# EAGLE schematic Servo_Control (EAGLE 9.1.3)
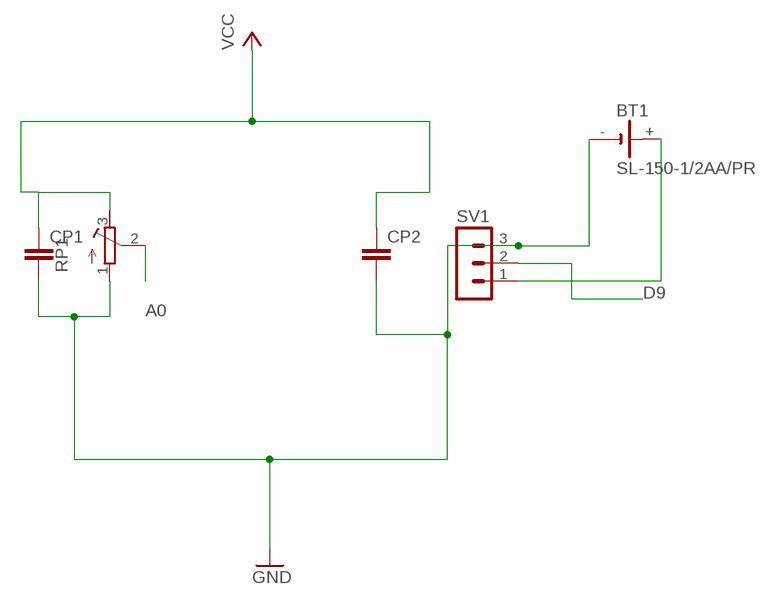
[diagram p0: schematic, sheet 1]

## Parts
BT1  SL-150-1/2AA/PR  [SL-150-1/2AA/PR]
CP1  C2,5-3  [C2.5-3]
CP2  C2,5-3  [C2.5-3]
RP1  R-TRIMM4G/J  [RTRIM4G/J]
SV1  MA03-1  [MA03-1]

## Nets
A0: RP1.2(S)
A5V: CP1.1 CP2.1 RP1.3(E) ; supply symbol labelled VCC
D9: SV1.2
GND1: BT1.- CP1.2 CP2.2 RP1.1(A) SV1.3 ; supply symbol labelled GND
N$2: BT1.+ SV1.1

## Library data of the parts
BT1 = battery:SL-150-1/2AA/PR: LI BATTERY Sonnenschein
CP1 CP2 = capacitor-wima:C: CAPACITOR naming: grid - package width
RP1 = rcl:R-TRIMM: Trimm resistor; SPICEMODEL: X; SPICEPREFIXL: POT
SV1 = con-lstb:MA03-1: PIN HEADER; OC_FARNELL: unknown; OC_NEWARK: unknown